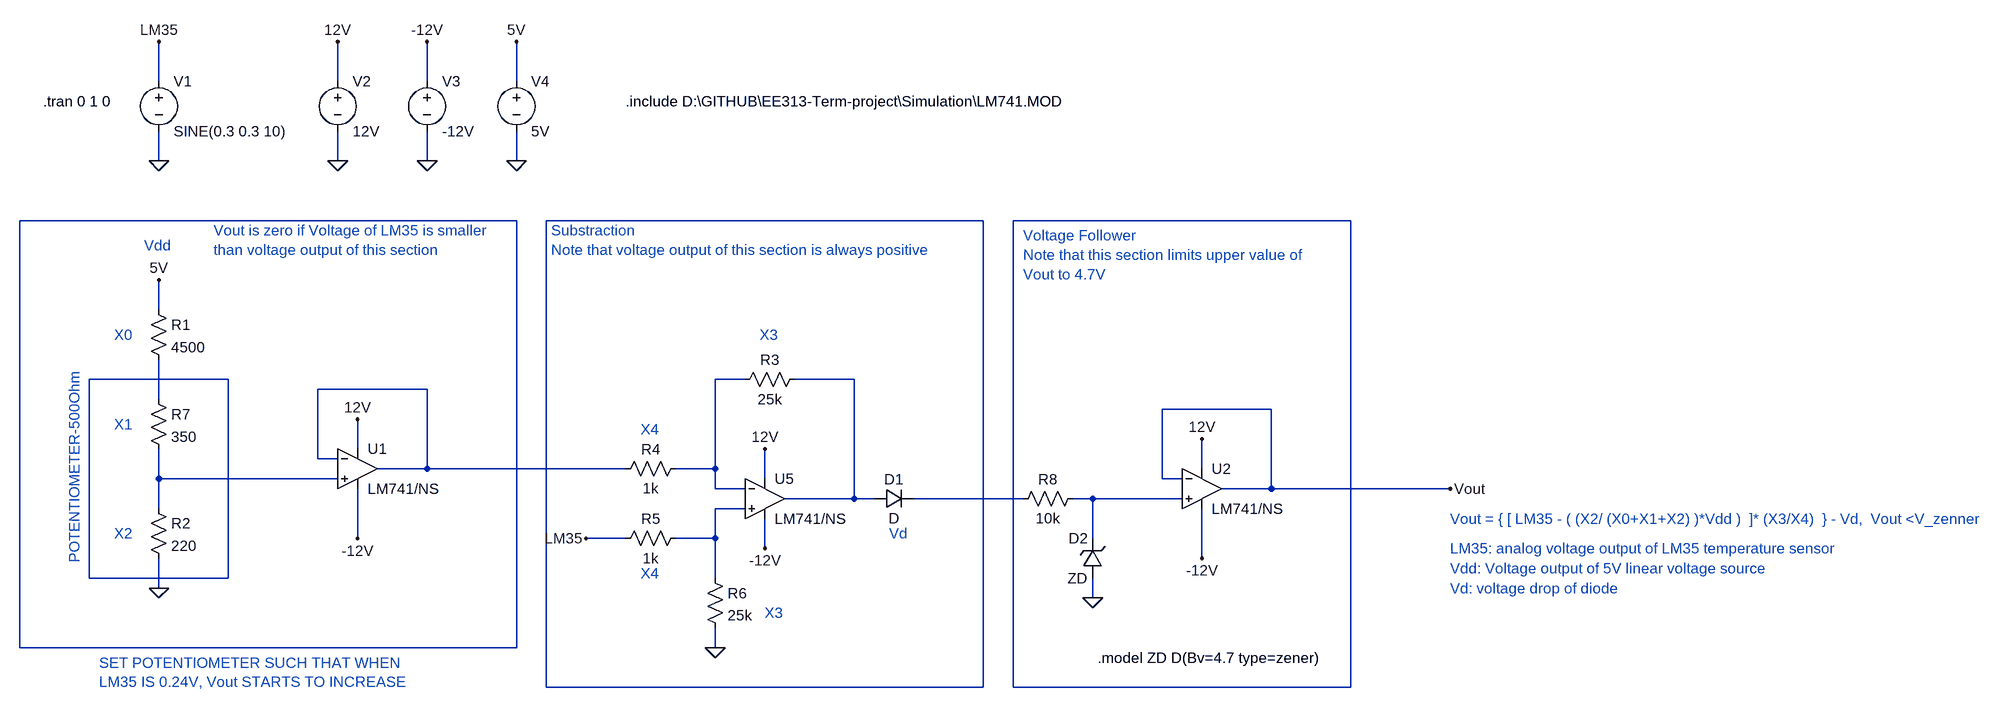
[diagram p0: schematic Sensing Unit.asc]
Sensing Unit.asc, the LTspice schematic file:
Version 4
SHEET 1 4272 2160
WIRE -912 320 -912 256
WIRE -624 320 -624 256
WIRE -480 320 -480 256
WIRE -336 320 -336 256
WIRE -912 448 -912 400
WIRE -624 448 -624 400
WIRE -480 448 -480 400
WIRE -336 448 -336 400
WIRE -336 544 -1136 544
WIRE 416 544 -288 544
WIRE 1008 544 464 544
WIRE -912 688 -912 640
WIRE -800 800 -1024 800
WIRE 32 800 -16 800
WIRE 208 800 112 800
WIRE -480 816 -656 816
WIRE -912 832 -912 768
WIRE 880 848 704 848
WIRE -592 912 -592 864
WIRE -656 928 -656 816
WIRE -624 928 -656 928
WIRE -480 944 -480 816
WIRE -480 944 -560 944
WIRE -160 944 -480 944
WIRE -16 944 -16 800
WIRE -16 944 -80 944
WIRE 768 944 768 896
WIRE -912 960 -912 912
WIRE -624 960 -912 960
WIRE 64 960 64 912
WIRE 704 960 704 848
WIRE 736 960 704 960
WIRE -16 976 -16 944
WIRE 32 976 -16 976
WIRE 880 976 880 848
WIRE 880 976 800 976
WIRE 1168 976 880 976
WIRE 208 992 208 800
WIRE 208 992 96 992
WIRE 240 992 208 992
WIRE 480 992 304 992
WIRE 592 992 560 992
WIRE 736 992 592 992
WIRE -912 1008 -912 960
WIRE 32 1008 -16 1008
WIRE -592 1056 -592 976
WIRE -160 1056 -224 1056
WIRE -16 1056 -16 1008
WIRE -16 1056 -80 1056
WIRE 592 1056 592 992
WIRE 64 1072 64 1024
WIRE 768 1088 768 1008
WIRE -1024 1120 -1024 800
WIRE -800 1120 -800 800
WIRE -800 1120 -1024 1120
WIRE -16 1120 -16 1056
WIRE -912 1136 -912 1088
WIRE 592 1152 592 1120
WIRE -1136 1232 -1136 544
WIRE -336 1232 -336 544
WIRE -336 1232 -1136 1232
WIRE -16 1232 -16 1200
WIRE -288 1296 -288 544
WIRE 416 1296 416 544
WIRE 416 1296 -288 1296
WIRE 464 1296 464 544
WIRE 1008 1296 1008 544
WIRE 1008 1296 464 1296
FLAG -912 448 0
FLAG -912 256 LM35
FLAG -624 448 0
FLAG -624 256 12V
FLAG -912 640 5V
FLAG -912 1136 0
FLAG -224 1056 LM35
FLAG -592 864 12V
FLAG -480 448 0
FLAG -480 256 -12V
FLAG -592 1056 -12V
FLAG -336 448 0
FLAG -336 256 5V
FLAG 64 912 12V
FLAG -16 1232 0
FLAG 64 1072 -12V
FLAG 768 896 12V
FLAG 768 1088 -12V
FLAG 1168 976 Vout
FLAG 592 1152 0
SYMBOL OpAmps\\opamp2 64 928 R0
SYMATTR InstName U5
SYMATTR Value LM741/NS
SYMBOL voltage -912 304 R0
WINDOW 123 0 0 Left 0
WINDOW 39 0 0 Left 0
SYMATTR InstName V1
SYMATTR Value SINE(0.3 0.3 10)
SYMBOL voltage -624 304 R0
WINDOW 123 0 0 Left 0
WINDOW 39 0 0 Left 0
SYMATTR InstName V2
SYMATTR Value 12V
SYMBOL res -928 672 R0
SYMATTR InstName R1
SYMATTR Value 4500
SYMBOL res -928 992 R0
SYMATTR InstName R2
SYMATTR Value 220
SYMBOL res 128 784 R90
WINDOW 0 0 56 VBottom 2
WINDOW 3 32 56 VTop 2
SYMATTR InstName R3
SYMATTR Value 25k
SYMBOL res -64 928 R90
WINDOW 0 0 56 VBottom 2
WINDOW 3 32 56 VTop 2
SYMATTR InstName R4
SYMATTR Value 1k
SYMBOL res -64 1040 R90
WINDOW 0 0 56 VBottom 2
WINDOW 3 32 56 VTop 2
SYMATTR InstName R5
SYMATTR Value 1k
SYMBOL res -32 1104 R0
SYMATTR InstName R6
SYMATTR Value 25k
SYMBOL OpAmps\\opamp2 -592 880 R0
SYMATTR InstName U1
SYMATTR Value LM741/NS
SYMBOL voltage -480 304 R0
WINDOW 123 0 0 Left 0
WINDOW 39 0 0 Left 0
SYMATTR InstName V3
SYMATTR Value -12V
SYMBOL voltage -336 304 R0
WINDOW 123 0 0 Left 0
WINDOW 39 0 0 Left 0
SYMATTR InstName V4
SYMATTR Value 5V
SYMBOL diode 240 1008 R270
WINDOW 0 32 32 VTop 2
WINDOW 3 0 32 VBottom 2
SYMATTR InstName D1
SYMBOL OpAmps\\opamp2 768 912 R0
SYMATTR InstName U2
SYMATTR Value LM741/NS
SYMBOL res -928 816 R0
SYMATTR InstName R7
SYMATTR Value 350
SYMBOL res 576 976 R90
WINDOW 0 0 56 VBottom 2
WINDOW 3 32 56 VTop 2
SYMATTR InstName R8
SYMATTR Value 10k
SYMBOL zener 608 1120 R180
WINDOW 0 24 64 Left 2
WINDOW 3 24 0 Left 2
SYMATTR InstName D2
SYMATTR Value ZD
TEXT -160 352 Left 2 !.include D:\\GITHUB\\EE313-Term-project\\Simulation\\LM741.MOD
TEXT -1098 352 Left 2 !.tran 0 1 0
TEXT -984 872 Left 2 ;X1
TEXT -984 1048 Left 2 ;X2
TEXT 56 728 Left 2 ;X3
TEXT -136 880 Left 2 ;X4
TEXT 64 1176 Left 2 ;X3
TEXT -136 1112 Left 2 ;X4
TEXT 264 1048 Left 2 ;Vd
TEXT -936 584 Left 2 ;Vdd
TEXT 1168 1024 Left 2 ;Vout = { [ LM35 - ( (X2/ (X0+X1+X2) )*Vdd )  ]* (X3/X4)  } - Vd,  Vout <V_zenner
TEXT 1168 1072 Left 2 ;LM35: analog voltage output of LM35 temperature sensor
TEXT 1168 1104 Left 2 ;Vdd: Voltage output of 5V linear voltage source
TEXT 1168 1136 Left 2 ;Vd: voltage drop of diode
TEXT -984 728 Left 2 ;X0
TEXT -824 560 Left 2 ;Vout is zero if Voltage of LM35 is smaller \nthan voltage output of this section
TEXT -280 560 Left 2 ;Substraction\nNote that voltage output of this section is always positive
TEXT 480 568 Left 2 ;Voltage Follower\nNote that this section limits upper value of\nVout to 4.7V
TEXT -1048 1096 VLeft 2 ;POTENTIOMETER-500Ohm
TEXT -1008 1256 Left 2 ;SET POTENTIOMETER SUCH THAT WHEN \nLM35 IS 0.24V, Vout STARTS TO INCREASE
TEXT 600 1248 Left 2 !.model ZD D(Bv=4.7 type=zener)

The netlist it stands for:
* Sensing Unit.asc
XU5 N012 N005 12V -12V N006 LM741/NS  ; pins In+ In- V+ V- OUT
V1 LM35 0 SINE(0.3 0.3 10)
V2 12V 0 12V
R1 5V N008 4500
R2 N009 0 220
R3 N006 N005 25k
R4 N005 N007 1k
R5 N012 LM35 1k
R6 N012 0 25k
XU1 N009 N007 12V -12V N007 LM741/NS  ; pins In+ In- V+ V- OUT
V3 -12V 0 -12V
V4 5V 0 5V
D1 N006 N010 D
XU2 N011 Vout 12V -12V Vout LM741/NS  ; pins In+ In- V+ V- OUT
R7 N008 N009 350
R8 N011 N010 10k
D2 0 N011 ZD
.model D D
.lib standard.dio
.include D:\GITHUB\EE313-Term-project\Simulation\LM741.MOD
.tran 0 1 0
* X1
* X2
* X3
* X4
* X3
* X4
* Vd
* Vdd
* Vout = { [ LM35 - ( (X2/ (X0+X1+X2) )*Vdd )  ]* (X3/X4)  } - Vd,  Vout <V_zenner
* LM35: analog voltage output of LM35 temperature sensor
* Vdd: Voltage output of 5V linear voltage source
* Vd: voltage drop of diode
* X0
* Vout is zero if Voltage of LM35 is smaller
* than voltage output of this section
* Substraction
* Note that voltage output of this section is always positive
* Voltage Follower
* Note that this section limits upper value of
* Vout to 4.7V
* POTENTIOMETER-500Ohm
* SET POTENTIOMETER SUCH THAT WHEN
* LM35 IS 0.24V, Vout STARTS TO INCREASE
.model ZD D(Bv=4.7 type=zener)
.backanno
.end